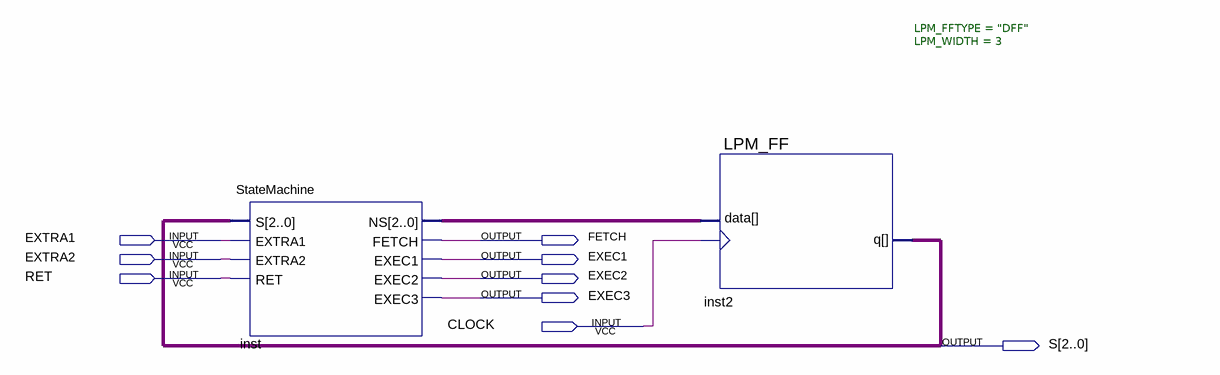
[diagram p0: schematic sheet]
// Quartus schematic StateMachineWithRegister.bdf as structural Verilog: 2 symbols, 9 pins
module StateMachineWithRegister (
  input  EXTRA1,
  input  EXTRA2,
  input  RET,
  input  CLOCK,
  output FETCH,
  output EXEC1,
  output EXEC2,
  output EXEC3,
  output [2:0] S
);

  wire [2:0] inst_ns;

  StateMachine inst (
    .S(S), .EXTRA1(EXTRA1), .EXTRA2(EXTRA2), .RET(RET), .NS(inst_ns), .FETCH(FETCH), .EXEC1(EXEC1),
    .EXEC2(EXEC2), .EXEC3(EXEC3));
  LPM_FF #(.LPM_FFTYPE("DFF"), .LPM_WIDTH(3)) inst2 (.clock(CLOCK), .data(inst_ns), .q(S));
endmodule
